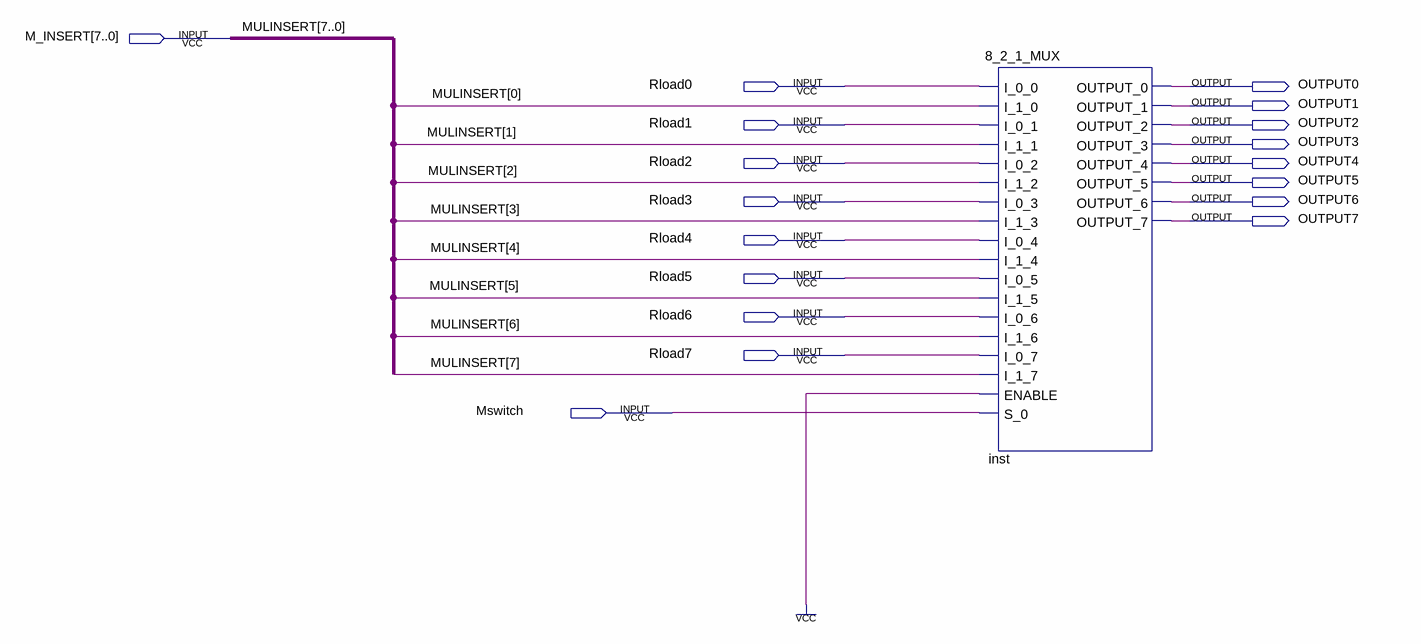
[diagram p0: schematic sheet]
// Quartus schematic MUL_IN_R1.bdf as structural Verilog: 1 symbols, 18 pins
module MUL_IN_R1 (
  input  [7:0] M_INSERT,
  input  Rload0,
  input  Rload1,
  input  Rload2,
  input  Rload3,
  input  Rload4,
  input  Rload5,
  input  Rload6,
  input  Rload7,
  input  Mswitch,
  output OUTPUT0,
  output OUTPUT1,
  output OUTPUT2,
  output OUTPUT3,
  output OUTPUT4,
  output OUTPUT5,
  output OUTPUT6,
  output OUTPUT7
);

  \8_2_1_MUX  inst (
    .I_0_0(Rload0), .I_1_0(M_INSERT[0]), .I_0_1(Rload1), .I_1_1(M_INSERT[1]), .I_0_2(Rload2),
    .I_1_2(M_INSERT[2]), .I_0_3(Rload3), .I_1_3(M_INSERT[3]), .I_0_4(Rload4), .I_1_4(M_INSERT[4]),
    .I_0_5(Rload5), .I_1_5(M_INSERT[5]), .I_0_6(Rload6), .I_1_6(M_INSERT[6]), .I_0_7(Rload7),
    .I_1_7(M_INSERT[7]), .ENABLE(1'b1), .S_0(Mswitch), .OUTPUT_0(OUTPUT0), .OUTPUT_1(OUTPUT1),
    .OUTPUT_2(OUTPUT2), .OUTPUT_3(OUTPUT3), .OUTPUT_4(OUTPUT4), .OUTPUT_5(OUTPUT5), .OUTPUT_6(OUTPUT6),
    .OUTPUT_7(OUTPUT7));

  // Other names for the same wires on the sheet: MULINSERT[7:0] = M_INSERT
endmodule
